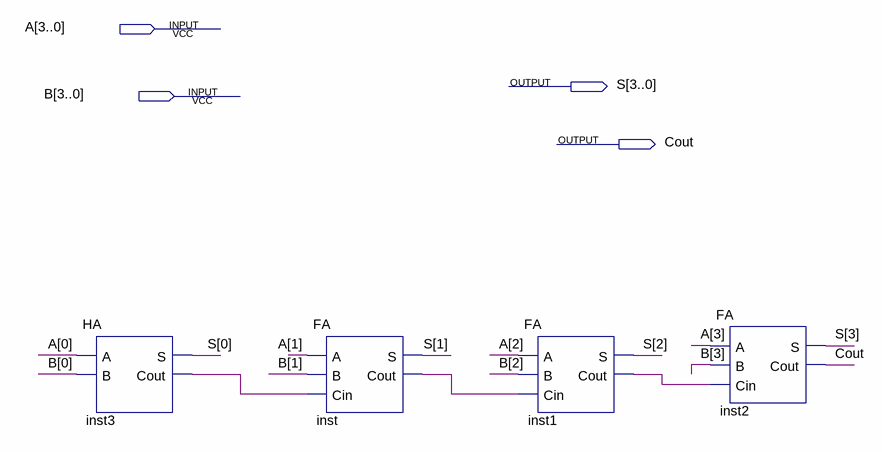
[diagram p0: schematic sheet]
// Quartus schematic RCA.bdf as structural Verilog: 4 symbols, 4 pins
module RCA (
  input  [3:0] A,
  input  [3:0] B,
  output [3:0] S,
  output Cout
);

  wire inst1_cout, inst3_cout, inst_cout;

  HA inst3 (.A(A[0]), .B(B[0]), .S(S[0]), .Cout(inst3_cout));
  FA inst (.A(A[1]), .B(B[1]), .Cin(inst3_cout), .S(S[1]), .Cout(inst_cout));
  FA inst1 (.A(A[2]), .B(B[2]), .Cin(inst_cout), .S(S[2]), .Cout(inst1_cout));
  FA inst2 (.A(A[3]), .B(B[3]), .Cin(inst1_cout), .S(S[3]), .Cout(Cout));
endmodule
